# EAGLE design dimmerac_supervisorio_REV3 (EAGLE 6.3)
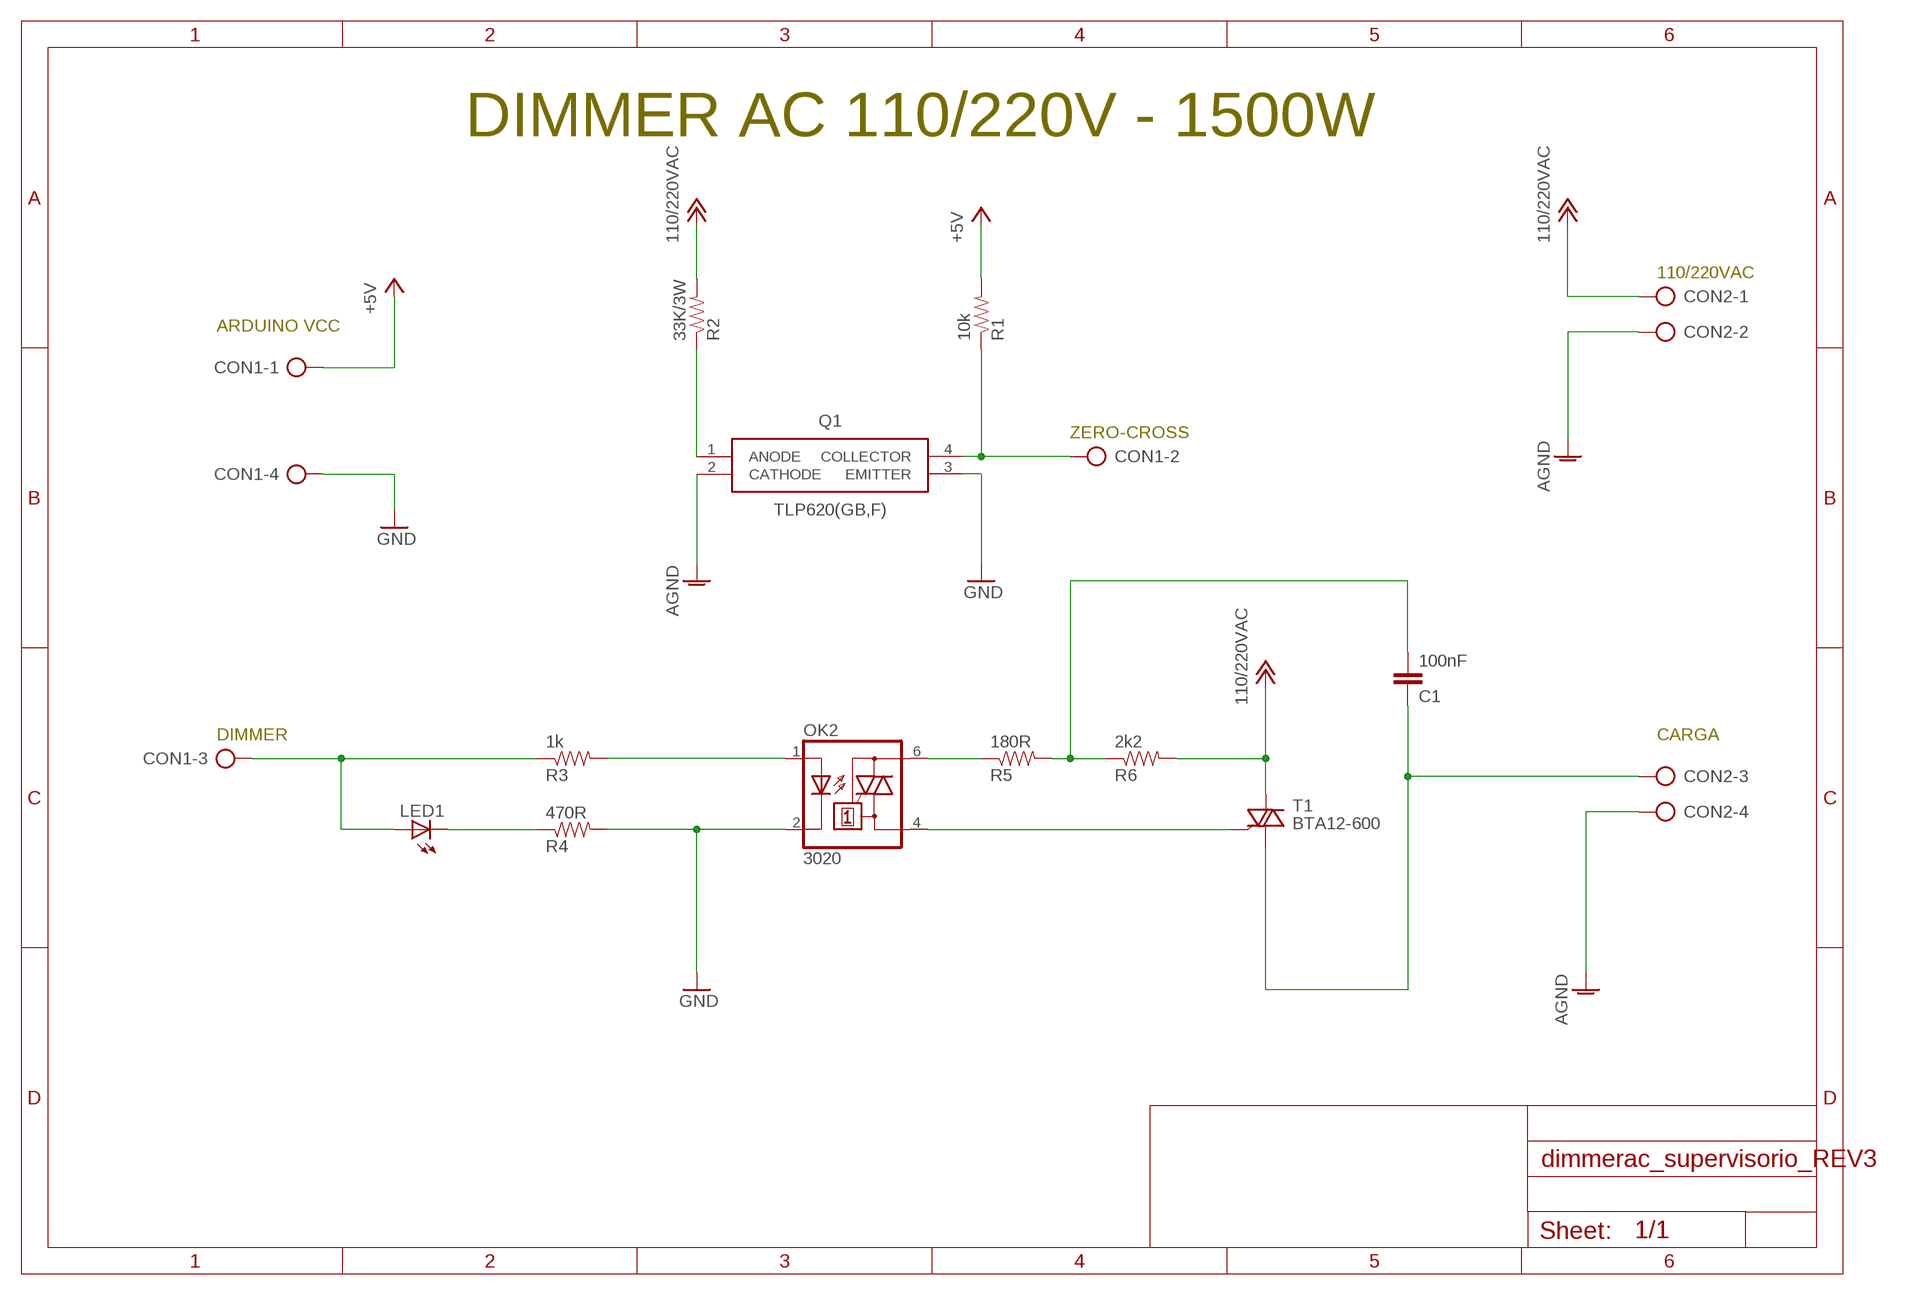
[diagram p0: schematic, sheet 1]

## Parts
C1  100nF  CAP_600V  [C15B7]
CON1  AK500/4  [AK500/4]
CON2  AK500/4  [AK500/4]
LED1  LED5MM  [LED5MM]
OK2  3020  MOC3020M  [DIL06]
Q1  TLP620(GB,F)  [DIP762W60P254L448H380Q4N]
R1  10k  RESISTORAXIAL-0.3  [AXIAL-0.3]
R2  33K/3W  RES_5W  [AXIAL-0.6]
R3  1k  RESISTORAXIAL-0.3  [AXIAL-0.3]
R4  470R  RESISTORAXIAL-0.3  [AXIAL-0.3]
R5  180R  RESISTORAXIAL-0.3  [AXIAL-0.3]
R6  2k2  RESISTORAXIAL-0.3  [AXIAL-0.3]
T1  BTA12-600  BT138-H  [TO220BH]

## Nets
+5V: CON1.1 R1.P$2
+12V: CON2.1 R2.P$2 R6.P$2 T1.T2(A2) ; supply symbol labelled 110/220VAC
AGND: CON2.2 CON2.4 Q1.2(CATHODE)
GND: CON1.4 OK2.2(C) Q1.3(EMITTER) R4.P$2
N$1: CON1.2 Q1.4(COLLECTOR) R1.P$1
N$2: Q1.1(ANODE) R2.P$1
N$4: OK2.1(A) R3.P$2
N$5: LED1.K(C) R4.P$1
N$6: CON1.3 LED1.A R3.P$1
N$7: OK2.4(A1) T1.G
N$8: OK2.6(A2) R5.P$1
N$9: C1.2 R5.P$2 R6.P$1
N$11: C1.1 CON2.3 T1.T1(A1)

## Notes on the sheet
- DIMMER AC 110/220V - 1500W
- 110/220VAC
- ARDUINO VCC
- ZERO-CROSS
- DIMMER | CARGA

## Library data of the parts
C1 = SerialLink:CAP_600V
CON1 CON2 = con-ptr500:AK500/4: CONNECTOR; OC_FARNELL: unknown; OC_NEWARK: unknown
LED1 = SparkFun-LED:LED: LEDs Standard schematic elements and footprints for 5mm, 3mm, 1206, and 0603 sized LEDs. 5mm - Spark Fun Electronics SKU : COM-00529 (and others)
OK2 = optocoupler:MOC30*M: RANDOM-PHASE OPTOISOLATORS TRIAC DRIVER OUTPUT Source: http://www.fairchildsemi.com MOC3020-M.pdf; MF: FAIRCHILD SEMICONDUCTOR; MPN: MOC3020-M; OC_FARNELL: 1505425; OC_NEWARK: 72K8895
Q1 = TLP620(GB_F):TLP620(GB,F): TOSHIBA Photocoupler GaAs Ired & PhotoTransistor <https://componentsearchengine.com/Images/1/TLP620%28GB%2CF%29.JPG> Source: Datasheet <http://docs-europe.electrocomponents.com/webdocs/0c2a/0900766b80c2aaef.pdf>; DESCRIPTION: TOSHIBA Photocoupler GaAs Ired & PhotoTransistor; HEIGHT: 3.8mm; MANUFACTURER_NAME: Toshiba; MANUFACTURER_PART_NUMBER: TLP620(GB,F); RS_PART_NUMBER: 0186189; SUPPLIER_NAME: RS
R1 R3-R6 = SparkFun-Resistors:RESISTOR: Resistor Basic schematic elements and footprints for 0603, 1206, and PTH resistors.
R2 = SerialLink:RES_5W
T1 = triac:BT138: TRIAC Source: http://www.semiconductors.philips.com BT138_SERIES_2.pdf

## Board
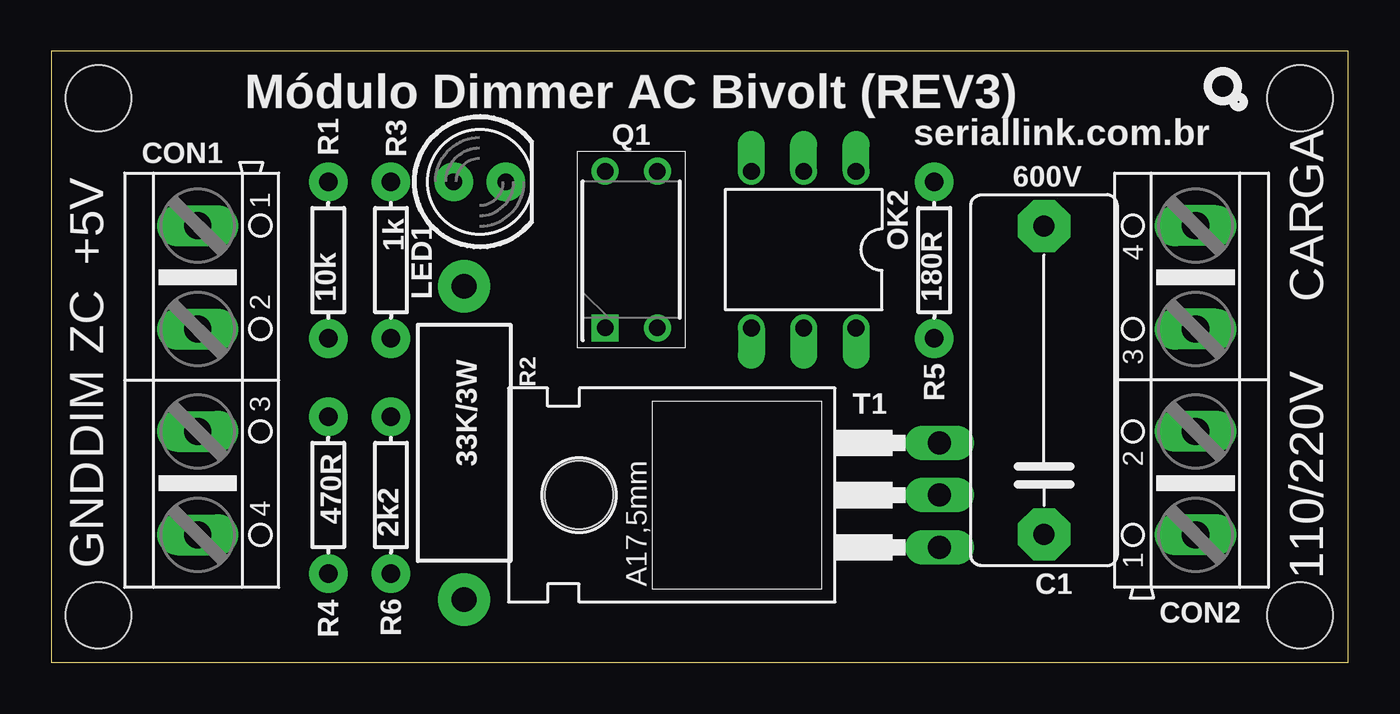
[diagram p1: board, top side]
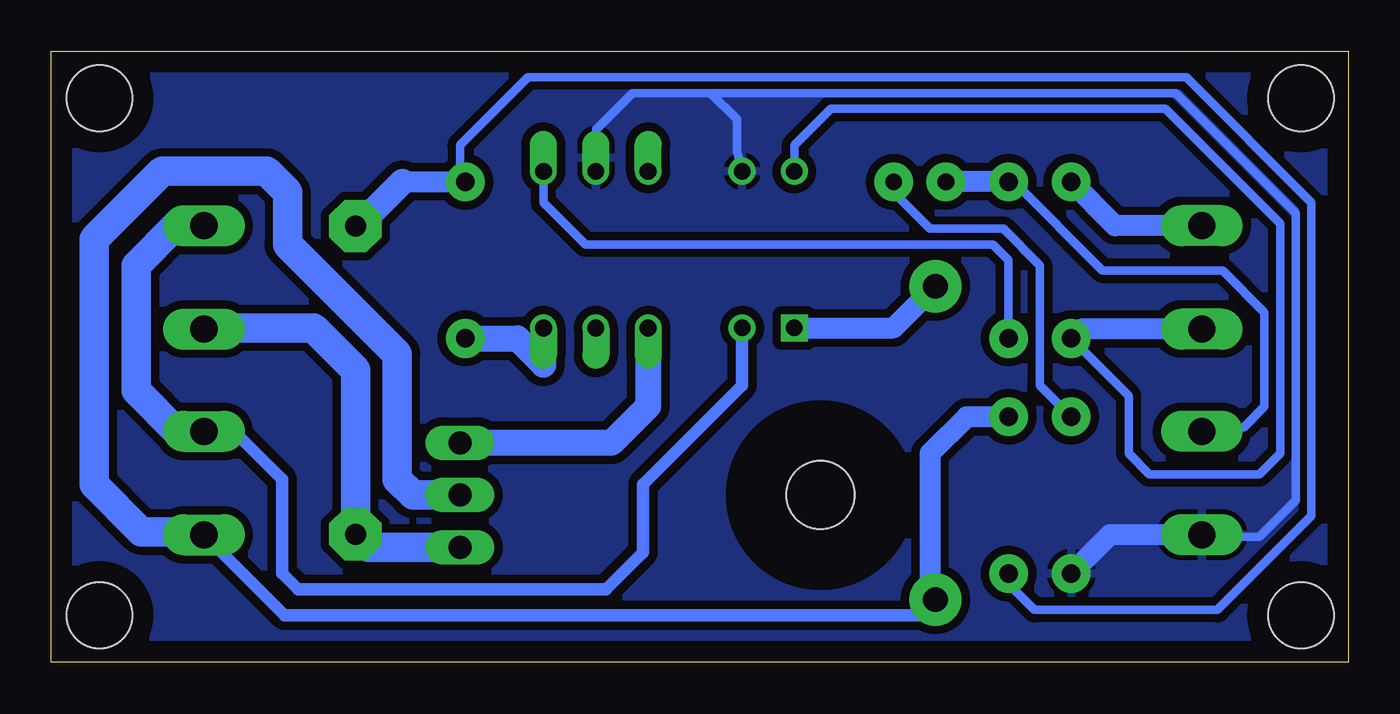
[diagram p2: board, bottom side, seen from below]

Size 63.04 x 29.71 mm. Coordinates in mm from the lower left corner, seen from the top.
Outline: 0,0 63.04,0 63.04,29.71 0,29.71 0,0
Copper layers (1*16): Top 0.035mm / dielectric 1.5mm / Bottom 0.035mm
Design rules "default": minimum track width 10mil, minimum drill 24mil, track to track 8mil, track to pad 8mil, pad to pad 8mil, via to via 8mil, smd to smd 8mil, copper to edge 40mil, drill to drill 8mil, minimum pad ring 10mil, minimum via ring 8mil, stop-mask expansion 4mil, vias tented up to drill 0mil, thermal gap 10mil
Holes 3.2 mm at 2.29,2.29 60.71,2.29 60.71,27.43 2.29,27.43

### Footprints (pad centres in the part's own frame; a part is rotated, then mirrored left to right if it is on the bottom)
C15B7 = drill 1.016 pad 2.54 octagon: 1 -7.493,0; 2 7.493,0
AK500/4 = drill 1.321 long: 1 -7.518,0; 2 -2.489,0; 3 2.489,0; 4 7.518,0
LED5MM = drill 0.813 pad 1.88: A -1.27,0; K 1.27,0
DIL06 = drill 0.813 offset: 1 -2.54,-3.81; 2 0,-3.81; 3 2.54,-3.81; 4 2.54,3.81; 5 0,3.81; 6 -2.54,3.81
DIP762W60P254L448H380Q4N = drill 0.8 pad 1.2 square: 1 -3.81,1.27 | drill 0.8 pad 1.2: 2 -3.81,-1.27; 3 3.81,-1.27; 4 3.81,1.27
AXIAL-0.3 = drill 0.9 pad 1.88: P$1 -3.81,0; P$2 3.81,0
AXIAL-0.6 = drill 1.2 pad 2.54: P$1 -7.62,0; P$2 7.62,0
TO220BH = drill 1.118 long: G 2.54,-6.35; T1 -2.54,-6.35; T2 0,-6.35 | hole 3.302: 0,11.176

### Placement (x,y rotation side)
C1  48.26,13.72 90 top
CON1  7.11,13.72 270 top
CON2  55.63,13.72 90 top
LED1  20.83,23.37 0 top
OK2  36.58,20.07 180 top
Q1  28.19,20.07 90 top
R1  13.46,19.56 90 top
R2  20.07,10.67 270 top
R3  16.51,19.56 270 top
R4  13.46,8.13 270 top
R5  42.93,19.56 90 top
R6  16.51,8.13 90 top
T1  36.83,8.13 90 top

### Tracks (layer width: path | path; a pad name or v marks a point on that pad's centre or on a via)
+5V
  Bottom 1.016: CON1.1 11.33,21.23 R1.P$2
+12V
  Bottom 0.61: CON2.1 51.71,2.29 20.83,2.29 R2.P$2
  Bottom 1.016: R6.P$2 18.54,11.94 20.32,10.16 20.32,3.3 R2.P$2
  Bottom 1.422: T1.T2 45.47,8.13 46.23,8.89 46.23,14.99 51.56,20.32 51.56,22.86 52.58,23.88 57.66,23.88 60.96,20.57 60.96,8.64 58.67,6.35 55.78,6.35 CON2.1
AGND
  Bottom 0.61: CON2.2 54.15,11.23 51.82,8.89 51.82,4.32 51.05,3.56 36.07,3.56 34.29,5.33 34.29,8.64 29.46,13.46 Q1.2
  Bottom 1.422: CON2.4 57,21.23 58.93,19.3 58.93,13.21 56.9,11.18 55.68,11.18 CON2.2
GND
  Bottom 0.406: OK2.2 36.58,25.91 34.8,27.69 30.99,27.69 | 30.99,27.69 8.38,27.69 2.54,21.84 2.54,7.87 4.32,6.1 7.01,6.1 | Q1.3 29.72,24.89 29.72,26.42 30.99,27.69
  Bottom 0.61: 7.01,6.1 CON1.4
  Bottom 1.016: CON1.4 11.58,6.2 R4.P$2
  pour Bottom (isolate 0.406): 0,0 62.99,0 62.99,29.72 0,29.72
N$1
  Bottom 0.406: Q1.4 26.92,25.15 25.15,26.92 8.89,26.92 3.3,21.34 3.3,10.16 4.32,9.14 9.65,9.14 10.67,10.16 10.67,12.95 R1.P$1
  Bottom 1.016: CON1.2 13.01,16.2 R1.P$1
N$2
  Bottom 1.016: Q1.1 22.1,16.26 R2.P$1
N$4
  Bottom 0.406: R3.P$2 16.51,19.56 17.27,20.32 37.08,20.32 39.12,22.35 OK2.1
N$5
  Bottom 0.406: LED1.K 22.1,22.86 20.32,21.08 16.76,21.08 14.99,19.3 14.99,13.46 R4.P$1
N$6
  Bottom 0.406: R3.P$1 16.26,23.37 11.94,19.05 6.1,19.05 4.06,17.02 4.06,12.45 5.08,11.43 6.91,11.43 CON1.3
  Bottom 1.016: R3.P$1 LED1.A
N$7
  Bottom 1.27: OK2.4 34.04,12.45 35.81,10.67 T1.G
N$8
  Bottom 1.27: R5.P$1 40.39,15.75 39.12,14.48 OK2.6
N$9
  Bottom 0.406: R6.P$1 16.51,3.81 15.24,2.54 6.35,2.54 1.78,7.11 1.78,22.35 7.87,28.45 39.88,28.45 43.18,25.15 43.18,23.62 R5.P$2
  Bottom 1.016: 45.97,23.37 R5.P$2
  Bottom 1.27: C1.2 48.13,21.21 45.97,23.37
N$11
  Bottom 1.422: T1.T1 47.62,5.59 C1.1 48.26,14.22 50.29,16.26 55.58,16.26 CON2.3

### Text on the board
tPlace: Módulo Dimmer AC Bivolt (REV3) | seriallink.com.br | 600V | +5V | CARGA | ZC | DIM | GND | 110/220V
tValues: TLP620 | Plataforma Supervisório